# EAGLE schematic sindal (EAGLE 9.6.2)
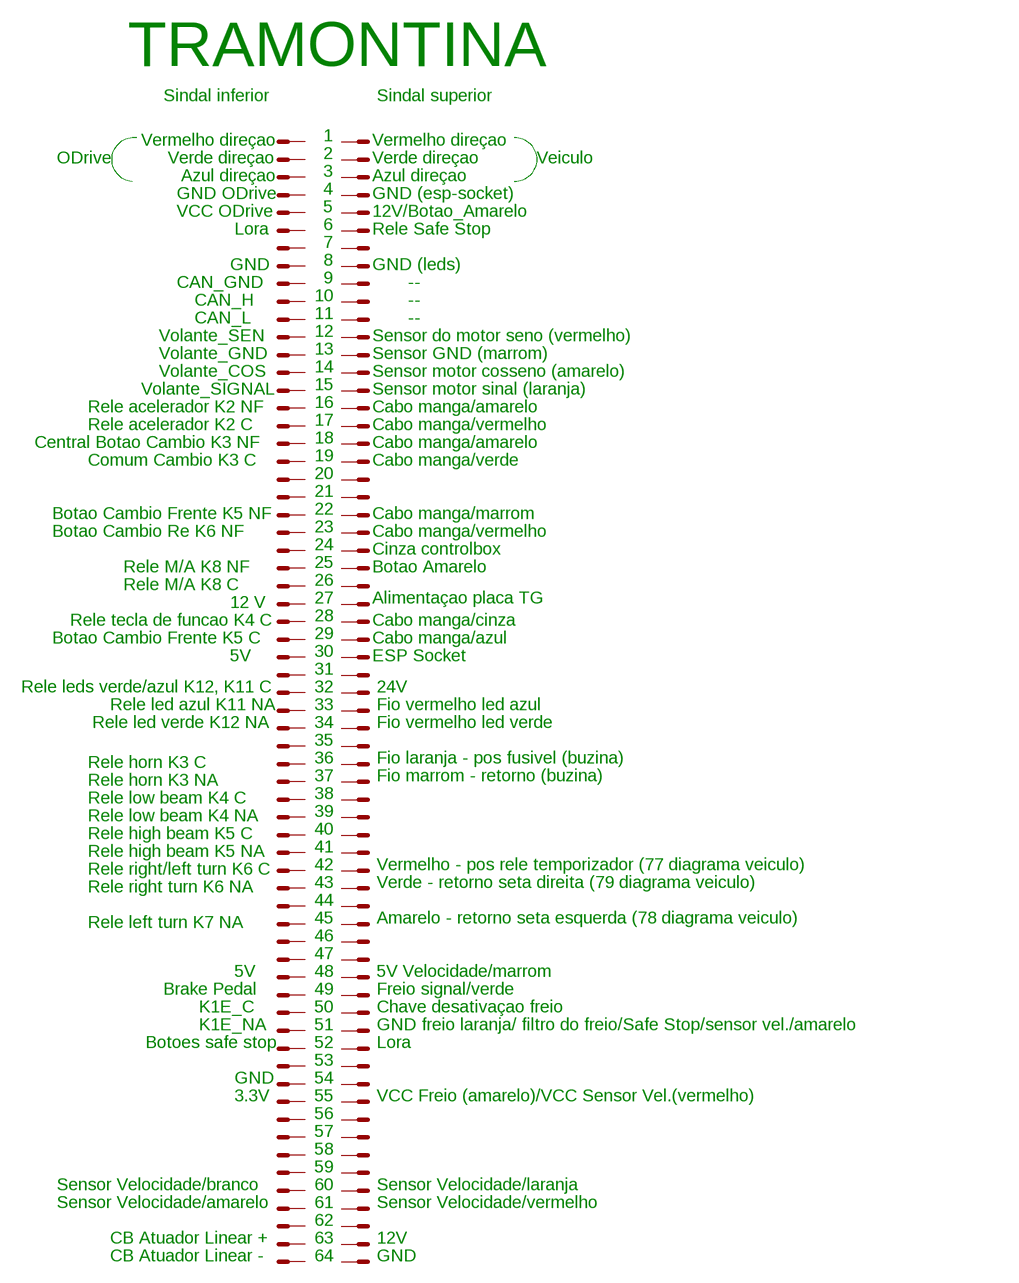
[diagram p0: schematic, sheet 1]

## Parts
X1  332-48  [332-48]
X2  332-48  [332-48]
X3  332-48  [332-48]
X4  332-48  [332-48]
X5  332-48  [332-48]
X6  332-48  [332-48]
X7  332-48  [332-48]
X8  332-48  [332-48]
X9  332-48  [332-48]
X10  332-48  [332-48]
X11  332-48  [332-48]
X12  332-48  [332-48]
X13  332-48  [332-48]
X14  332-48  [332-48]
X15  332-48  [332-48]
X16  332-48  [332-48]
X17  332-48  [332-48]
X18  332-48  [332-48]
X19  332-48  [332-48]
X20  332-48  [332-48]
X21  332-48  [332-48]
X22  332-48  [332-48]
X23  332-48  [332-48]
X24  332-48  [332-48]
X25  332-48  [332-48]
X26  332-48  [332-48]
X27  332-48  [332-48]
Unconnected: X1.1 X1.2 X1.3 X1.4 X1.5 X1.6 X1.7 X1.8 X1.9 X1.10 X1.11 X1.12 X1.13 X1.14 X1.15 X1.16 X1.17 X1.18 X1.19 X1.20 X1.21 X1.22 X1.23 X1.24 X1.25 X1.26 X1.27 X1.28 X1.29 X1.30 X1.31 X1.32 X1.33 X1.34 X1.35 X1.36 X1.37 X1.38 X1.39 X1.40 X1.41 X1.42 X1.43 X1.44 X1.45 X1.46 X1.47 X1.48 X2.1 X2.2 X2.3 X2.4 X2.5 X2.6 X2.7 X2.8 X2.9 X2.10 X2.11 X2.12 X2.13 X2.14 X2.15 X2.16 X2.17 X2.18 X2.19 X2.20 X2.21 X2.22 X2.23 X2.24 X2.25 X2.26 X2.27 X2.28 X2.29 X2.30 X2.31 X2.32 X2.33 X2.34 X2.35 X2.36 X2.37 X2.38 X2.39 X2.40 X2.41 X2.42 X2.43 X2.44 X2.45 X2.46 X2.47 X2.48 X3.1 X3.2 X3.3 X3.4 X3.5 X3.6 X3.7 X3.8 X3.9 X3.10 X3.11 X3.12 X3.13 X3.14 X3.15 X3.16 X3.17 X3.18 X3.19 X3.20 X3.21 X3.22 X3.23 X3.24 X3.25 X3.26 X3.27 X3.28 X3.29 X3.30 X3.31 X3.32 X3.33 X3.34 X3.35 X3.36 X3.37 X3.38 X3.39 X3.40 X3.41 X3.42 X3.43 X3.44 X3.45 X3.46 X3.47 X3.48 X4.1 X4.2 X4.3 X4.4 X4.5 X4.6 X4.7 X4.8 X4.9 X4.10 X4.11 X4.12 X4.13 X4.14 X4.15 X4.16 X4.17 X4.18 X4.19 X4.20 X4.21 X4.22 X4.23 X4.24 X4.25 X4.26 X4.27 X4.28 X4.29 X4.30 X4.31 X4.32 X4.33 X4.34 X4.35 X4.36 X4.37 X4.38 X4.39 X4.40 X4.41 X4.42 X4.43 X4.44 X4.45 X4.46 X4.47 X4.48 X5.1 X5.2 X5.3 X5.4 X5.5 X5.6 X5.7 X5.8 X5.9 X5.10 X5.11 X5.12 X5.13 X5.14 X5.15 X5.16 X5.17 X5.18 X5.19 X5.20 X5.21 X5.22 X5.23 X5.24 X5.25 X5.26 X5.27 X5.28 X5.29 X5.30 X5.31 X5.32 X5.33 X5.34 X5.35 X5.36 X5.37 X5.38 X5.39 X5.40 X5.41 X5.42 X5.43 X5.44 X5.45 X5.46 X5.47 X5.48 X6.1 X6.2 X6.3 X6.4 X6.5 X6.6 X6.7 X6.8 X6.9 X6.10 X6.11 X6.12 X6.13 X6.14 X6.15 X6.16 X6.17 X6.18 X6.19 X6.20 X6.21 X6.22 X6.23 X6.24 X6.25 X6.26 X6.27 X6.28 X6.29 X6.30 X6.31 X6.32 X6.33 X6.34 X6.35 X6.36 X6.37 X6.38 X6.39 X6.40 X6.41 X6.42 X6.43 X6.44 X6.45 X6.46 X6.47 X6.48 X7.1 X7.2 X7.3 X7.4 X7.5 X7.6 X7.7 X7.8 X7.9 X7.10 X7.11 X7.12 X7.13 X7.14 X7.15 X7.16 X7.17 X7.18 X7.19 X7.20 X7.21 X7.22 X7.23 X7.24 X7.25 X7.26 X7.27 X7.28 X7.29 X7.30 X7.31 X7.32 X7.33 X7.34 X7.35 X7.36 X7.37 X7.38 X7.39 X7.40 X7.41 X7.42 X7.43 X7.44 X7.45 X7.46 X7.47 X7.48 X8.1 X8.2 X8.3 X8.4 X8.5 X8.6 X8.7 X8.8 X8.9 X8.10 X8.11 X8.12 X8.13 X8.14 X8.15 X8.16 X8.17 X8.18 X8.19 X8.20 X8.21 X8.22 X8.23 X8.24 X8.25 X8.26 X8.27 X8.28 X8.29 X8.30 X8.31 X8.32 X8.33 X8.34 X8.35 X8.36 X8.37 X8.38 X8.39 X8.40 X8.41 X8.42 X8.43 X8.44 X8.45 X8.46 X8.47 X8.48 X9.1 X9.2 X9.3 X9.4 X9.5 X9.6 X9.7 X9.8 X9.9 X9.10 X9.11 X9.12 X9.13 X9.14 X9.15 X9.16 X9.17 X9.18 X9.19 X9.20 X9.21 X9.22 X9.23 X9.24 X9.25 X9.26 X9.27 X9.28 X9.29 X9.30 X9.31 X9.32 X9.33 X9.34 X9.35 X9.36 X9.37 X9.38 X9.39 X9.40 X9.41 X9.42 X9.43 X9.44 X9.45 X9.46 X9.47 X9.48 X10.1 X10.2 X10.3 X10.4 X10.5 X10.6 X10.7 X10.8 X10.9 X10.10 X10.11 X10.12 X10.13 X10.14 X10.15 X10.16 X10.17 X10.18 X10.19 X10.20 X10.21 X10.22 X10.23 X10.24 X10.25 X10.26 X10.27 X10.28 X10.29 X10.30 X10.31 X10.32 X10.33 X10.34 X10.35 X10.36 X10.37 X10.38 X10.39 X10.40 X10.41 X10.42 X10.43 X10.44 X10.45 X10.46 X10.47 X10.48 X11.1 X11.2 X11.3 X11.4 X11.5 X11.6 X11.7 X11.8 X11.9 X11.10 X11.11 X11.12 X11.13 X11.14 X11.15 X11.16 X11.17 X11.18 X11.19 X11.20 X11.21 X11.22 X11.23 X11.24 X11.25 X11.26 X11.27 X11.28 X11.29 X11.30 X11.31 X11.32 X11.33 X11.34 X11.35 X11.36 X11.37 X11.38 X11.39 X11.40 X11.41 X11.42 X11.43 X11.44 X11.45 X11.46 X11.47 X11.48 X12.1 X12.2 X12.3 X12.4 X12.5 X12.6 X12.7 X12.8 X12.9 X12.10 X12.11 X12.12 X12.13 X12.14 X12.15 X12.16 X12.17 X12.18 X12.19 X12.20 X12.21 X12.22 X12.23 X12.24 X12.25 X12.26 X12.27 X12.28 X12.29 X12.30 X12.31 X12.32 X12.33 X12.34 X12.35 X12.36 X12.37 X12.38 X12.39 X12.40 X12.41 X12.42 X12.43 X12.44 X12.45 X12.46 X12.47 X12.48 X13.1 X13.2 X13.3 X13.4 X13.5 X13.6 X13.7 X13.8 X13.9 X13.10 X13.11 X13.12 X13.13 X13.14 X13.15 X13.16 X13.17 X13.18 X13.19 X13.20 X13.21 X13.22 X13.23 X13.24 X13.25 X13.26 X13.27 X13.28 X13.29 X13.30 X13.31 X13.32 X13.33 X13.34 X13.35 X13.36 X13.37 X13.38 X13.39 X13.40 X13.41 X13.42 X13.43 X13.44 X13.45 X13.46 X13.47 X13.48 X14.1 X14.2 X14.3 X14.4 X14.5 X14.6 X14.7 X14.8 X14.9 X14.10 X14.11 X14.12 X14.13 X14.14 X14.15 X14.16 X14.17 X14.18 X14.19 X14.20 X14.21 X14.22 X14.23 X14.24 X14.25 X14.26 X14.27 X14.28 X14.29 X14.30 X14.31 X14.32 X14.33 X14.34 X14.35 X14.36 X14.37 X14.38 X14.39 X14.40 X14.41 X14.42 X14.43 X14.44 X14.45 X14.46 X14.47 X14.48 X15.1 X15.2 X15.3 X15.4 X15.5 X15.6 X15.7 X15.8 X15.9 X15.10 X15.11 X15.12 X15.13 X15.14 X15.15 X15.16 X15.17 X15.18 X15.19 X15.20 X15.21 X15.22 X15.23 X15.24 X15.25 X15.26 X15.27 X15.28 X15.29 X15.30 X15.31 X15.32 X15.33 X15.34 X15.35 X15.36 X15.37 X15.38 X15.39 X15.40 X15.41 X15.42 X15.43 X15.44 X15.45 X15.46 X15.47 X15.48 X16.1 X16.2 X16.3 X16.4 X16.5 X16.6 X16.7 X16.8 X16.9 X16.10 X16.11 X16.12 X16.13 X16.14 X16.15 X16.16 X16.17 X16.18 X16.19 X16.20 X16.21 X16.22 X16.23 X16.24 X16.25 X16.26 X16.27 X16.28 X16.29 X16.30 X16.31 X16.32 X16.33 X16.34 X16.35 X16.36 X16.37 X16.38 X16.39 X16.40 X16.41 X16.42 X16.43 X16.44 X16.45 X16.46 X16.47 X16.48 X17.1 X17.2 X17.3 X17.4 X17.5 X17.6 X17.7 X17.8 X17.9 X17.10 X17.11 X17.12 X17.13 X17.14 X17.15 X17.16 X17.17 X17.18 X17.19 X17.20 X17.21 X17.22 X17.23 X17.24 X17.25 X17.26 X17.27 X17.28 X17.29 X17.30 X17.31 X17.32 X17.33 X17.34 X17.35 X17.36 X17.37 X17.38 X17.39 X17.40 X17.41 X17.42 X17.43 X17.44 X17.45 X17.46 X17.47 X17.48 X18.1 X18.2 X18.3 X18.4 X18.5 X18.6 X18.7 X18.8 X18.9 X18.10 X18.11 X18.12 X18.13 X18.14 X18.15 X18.16 X18.17 X18.18 X18.19 X18.20 X18.21 X18.22 X18.23 X18.24 X18.25 X18.26 X18.27 X18.28 X18.29 X18.30 X18.31 X18.32 X18.33 X18.34 X18.35 X18.36 X18.37 X18.38 X18.39 X18.40 X18.41 X18.42 X18.43 X18.44 X18.45 X18.46 X18.47 X18.48 X19.1 X19.2 X19.3 X19.4 X19.5 X19.6 X19.7 X19.8 X19.9 X19.10 X19.11 X19.12 X19.13 X19.14 X19.15 X19.16 X19.17 X19.18 X19.19 X19.20 X19.21 X19.22 X19.23 X19.24 X19.25 X19.26 X19.27 X19.28 X19.29 X19.30 X19.31 X19.32 X19.33 X19.34 X19.35 X19.36 X19.37 X19.38 X19.39 X19.40 X19.41 X19.42 X19.43 X19.44 X19.45 X19.46 X19.47 X19.48 X20.1 X20.2 X20.3 X20.4 X20.5 X20.6 X20.7 X20.8 X20.9 X20.10 X20.11 X20.12 X20.13 X20.14 X20.15 X20.16 X20.17 X20.18 X20.19 X20.20 X20.21 X20.22 X20.23 X20.24 X20.25 X20.26 X20.27 X20.28 X20.29 X20.30 X20.31 X20.32 X20.33 X20.34 X20.35 X20.36 X20.37 X20.38 X20.39 X20.40 X20.41 X20.42 X20.43 X20.44 X20.45 X20.46 X20.47 X20.48 X21.1 X21.2 X21.3 X21.4 X21.5 X21.6 X21.7 X21.8 X21.9 X21.10 X21.11 X21.12 X21.13 X21.14 X21.15 X21.16 X21.17 X21.18 X21.19 X21.20 X21.21 X21.22 X21.23 X21.24 X21.25 X21.26 X21.27 X21.28 X21.29 X21.30 X21.31 X21.32 X21.33 X21.34 X21.35 X21.36 X21.37 X21.38 X21.39 X21.40 X21.41 X21.42 X21.43 X21.44 X21.45 X21.46 X21.47 X21.48 X22.1 X22.2 X22.3 X22.4 X22.5 X22.6 X22.7 X22.8 X22.9 X22.10 X22.11 X22.12 X22.13 X22.14 X22.15 X22.16 X22.17 X22.18 X22.19 X22.20 X22.21 X22.22 X22.23 X22.24 X22.25 X22.26 X22.27 X22.28 X22.29 X22.30 X22.31 X22.32 X22.33 X22.34 X22.35 X22.36 X22.37 X22.38 X22.39 X22.40 X22.41 X22.42 X22.43 X22.44 X22.45 X22.46 X22.47 X22.48 X23.1 X23.2 X23.3 X23.4 X23.5 X23.6 X23.7 X23.8 X23.9 X23.10 X23.11 X23.12 X23.13 X23.14 X23.15 X23.16 X23.17 X23.18 X23.19 X23.20 X23.21 X23.22 X23.23 X23.24 X23.25 X23.26 X23.27 X23.28 X23.29 X23.30 X23.31 X23.32 X23.33 X23.34 X23.35 X23.36 X23.37 X23.38 X23.39 X23.40 X23.41 X23.42 X23.43 X23.44 X23.45 X23.46 X23.47 X23.48 X24.1 X24.2 X24.3 X24.4 X24.5 X24.6 X24.7 X24.8 X24.9 X24.10 X24.11 X24.12 X24.13 X24.14 X24.15 X24.16 X24.17 X24.18 X24.19 X24.20 X24.21 X24.22 X24.23 X24.24 X24.25 X24.26 X24.27 X24.28 X24.29 X24.30 X24.31 X24.32 X24.33 X24.34 X24.35 X24.36 X24.37 X24.38 X24.39 X24.40 X24.41 X24.42 X24.43 X24.44 X24.45 X24.46 X24.47 X24.48 X25.1 X25.2 X25.3 X25.4 X25.5 X25.6 X25.7 X25.8 X25.9 X25.10 X25.11 X25.12 X25.13 X25.14 X25.15 X25.16 X25.17 X25.18 X25.19 X25.20 X25.21 X25.22 X25.23 X25.24 X25.25 X25.26 X25.27 X25.28 X25.29 X25.30 X25.31 X25.32 X25.33 X25.34 X25.35 X25.36 X25.37 X25.38 X25.39 X25.40 X25.41 X25.42 X25.43 X25.44 X25.45 X25.46 X25.47 X25.48 X26.1 X26.2 X26.3 X26.4 X26.5 X26.6 X26.7 X26.8 X26.9 X26.10 X26.11 X26.12 X26.13 X26.14 X26.15 X26.16 X26.17 X26.18 X26.19 X26.20 X26.21 X26.22 X26.23 X26.24 X26.25 X26.26 X26.27 X26.28 X26.29 X26.30 X26.31 X26.32 X26.33 X26.34 X26.35 X26.36 X26.37 X26.38 X26.39 X26.40 X26.41 X26.42 X26.43 X26.44 X26.45 X26.46 X26.47 X26.48 X27.1 X27.2 X27.3 X27.4 X27.5 X27.6 X27.7 X27.8 X27.9 X27.10 X27.11 X27.12 X27.13 X27.14 X27.15 X27.16 X27.17 X27.18 X27.19 X27.20 X27.21 X27.22 X27.23 X27.24 X27.25 X27.26 X27.27 X27.28 X27.29 X27.30 X27.31 X27.32 X27.33 X27.34 X27.35 X27.36 X27.37 X27.38 X27.39 X27.40 X27.41 X27.42 X27.43 X27.44 X27.45 X27.46 X27.47 X27.48

## Notes on the sheet
- TRAMONTINA
- Sindal inferior | Sindal superior
- Vermelho direçao | 1 | Vermelho direçao
- ODrive | Verde direçao | 2 | Verde direçao | Veiculo
- Azul direçao | 3 | Azul direçao
- GND ODrive | 4 | GND (esp-socket)
- VCC ODrive | 5 | 12V/Botao_Amarelo
- Lora | 6 | Rele Safe Stop
- 7
- GND | 8 | GND (leds)
- CAN_GND | 9 | --
- CAN_H | 10 | --
- CAN_L | 11 | --
- Volante_SEN | 12 | Sensor do motor seno (vermelho)
- Volante_GND | 13 | Sensor GND (marrom)
- Volante_COS | 14 | Sensor motor cosseno (amarelo)
- Volante_SIGNAL | 15 | Sensor motor sinal (laranja)
- Rele acelerador K2 NF | 16 | Cabo manga/amarelo
- Rele acelerador K2 C | 17 | Cabo manga/vermelho
- Central Botao Cambio K3 NF | 18 | Cabo manga/amarelo
- Comum Cambio K3 C | 19 | Cabo manga/verde
- 20
- 21
- Botao Cambio Frente K5 NF | 22 | Cabo manga/marrom
- Botao Cambio Re K6 NF | 23 | Cabo manga/vermelho
- 24 | Cinza controlbox
- Rele M/A K8 NF | 25 | Botao Amarelo
- Rele M/A K8 C | 26
- 12 V | 27 | Alimentaçao placa TG
- Rele tecla de funcao K4 C | 28 | Cabo manga/cinza
- Botao Cambio Frente K5 C | 29 | Cabo manga/azul
- 5V | 30 | ESP Socket
- 31
- Rele leds verde/azul K12, K11 C | 32 | 24V
- Rele led azul K11 NA | 33 | Fio vermelho led azul
- Rele led verde K12 NA | 34 | Fio vermelho led verde
- 35
- Rele horn K3 C | 36 | Fio laranja - pos fusivel (buzina)
- Rele horn K3 NA | 37 | Fio marrom - retorno (buzina)
- Rele low beam K4 C | 38
- Rele low beam K4 NA | 39
- Rele high beam K5 C | 40
- Rele high beam K5 NA | 41
- Rele right/left turn K6 C | 42 | Vermelho - pos rele temporizador (77 diagrama veiculo)
- Rele right turn K6 NA | 43 | Verde - retorno seta direita (79 diagrama veiculo)
- 44
- Rele left turn K7 NA | 45 | Amarelo - retorno seta esquerda (78 diagrama veiculo)
- 46
- 47
- 5V | 48 | 5V Velocidade/marrom
- Brake Pedal | 49 | Freio signal/verde
- K1E_C | 50 | Chave desativaçao freio
- K1E_NA | 51 | GND freio laranja/ filtro do freio/Safe Stop/sensor vel./amarelo
- Botoes safe stop | 52 | Lora
- 53
- GND | 54
- 3.3V | 55 | VCC Freio (amarelo)/VCC Sensor Vel.(vermelho)
- 56
- 57
- 58
- 59
- Sensor Velocidade/branco | 60 | Sensor Velocidade/laranja
- Sensor Velocidade/amarelo | 61 | Sensor Velocidade/vermelho
- 62
- CB Atuador Linear + | 63 | 12V
- CB Atuador Linear - | 64 | GND

## Library data of the parts
X1-X27 = con-garry:332-48: 48 Pin - 2mm Dual Row Source: www.mpe-connector.de / garry_shortform_2012.pdf